# Altium schematic sheet SC941C_ETOR2.SchDoc: Entrées TOR 2/2
size 393 x 270 mm; CompanyName: Seccom; Address1: 521, rue du capt. François Garbit; Address2: 69440 Mornant; Address3: seccom@seccom.fr; Address4: www.seccom.fr; DocumentNumber: 4; SheetNumber: 4; SheetTotal: 9; PageSetup: Record=PageOptions|CenterHorizontal=True|CenterVertical=True|PrintScale=0.74|XCorrection=1.00|YCorrection=1.00|PrintKind=0|BorderSize=5000000|LeftOffset=0|BottomOffset=0|Orientation=2|PaperLength=1000|PaperWidth=1000|Scale=100|PaperSource=7|PrintQuality=-4|MediaType=1|DitherType=10|PaperKind=A4|PrintScaleMode=1
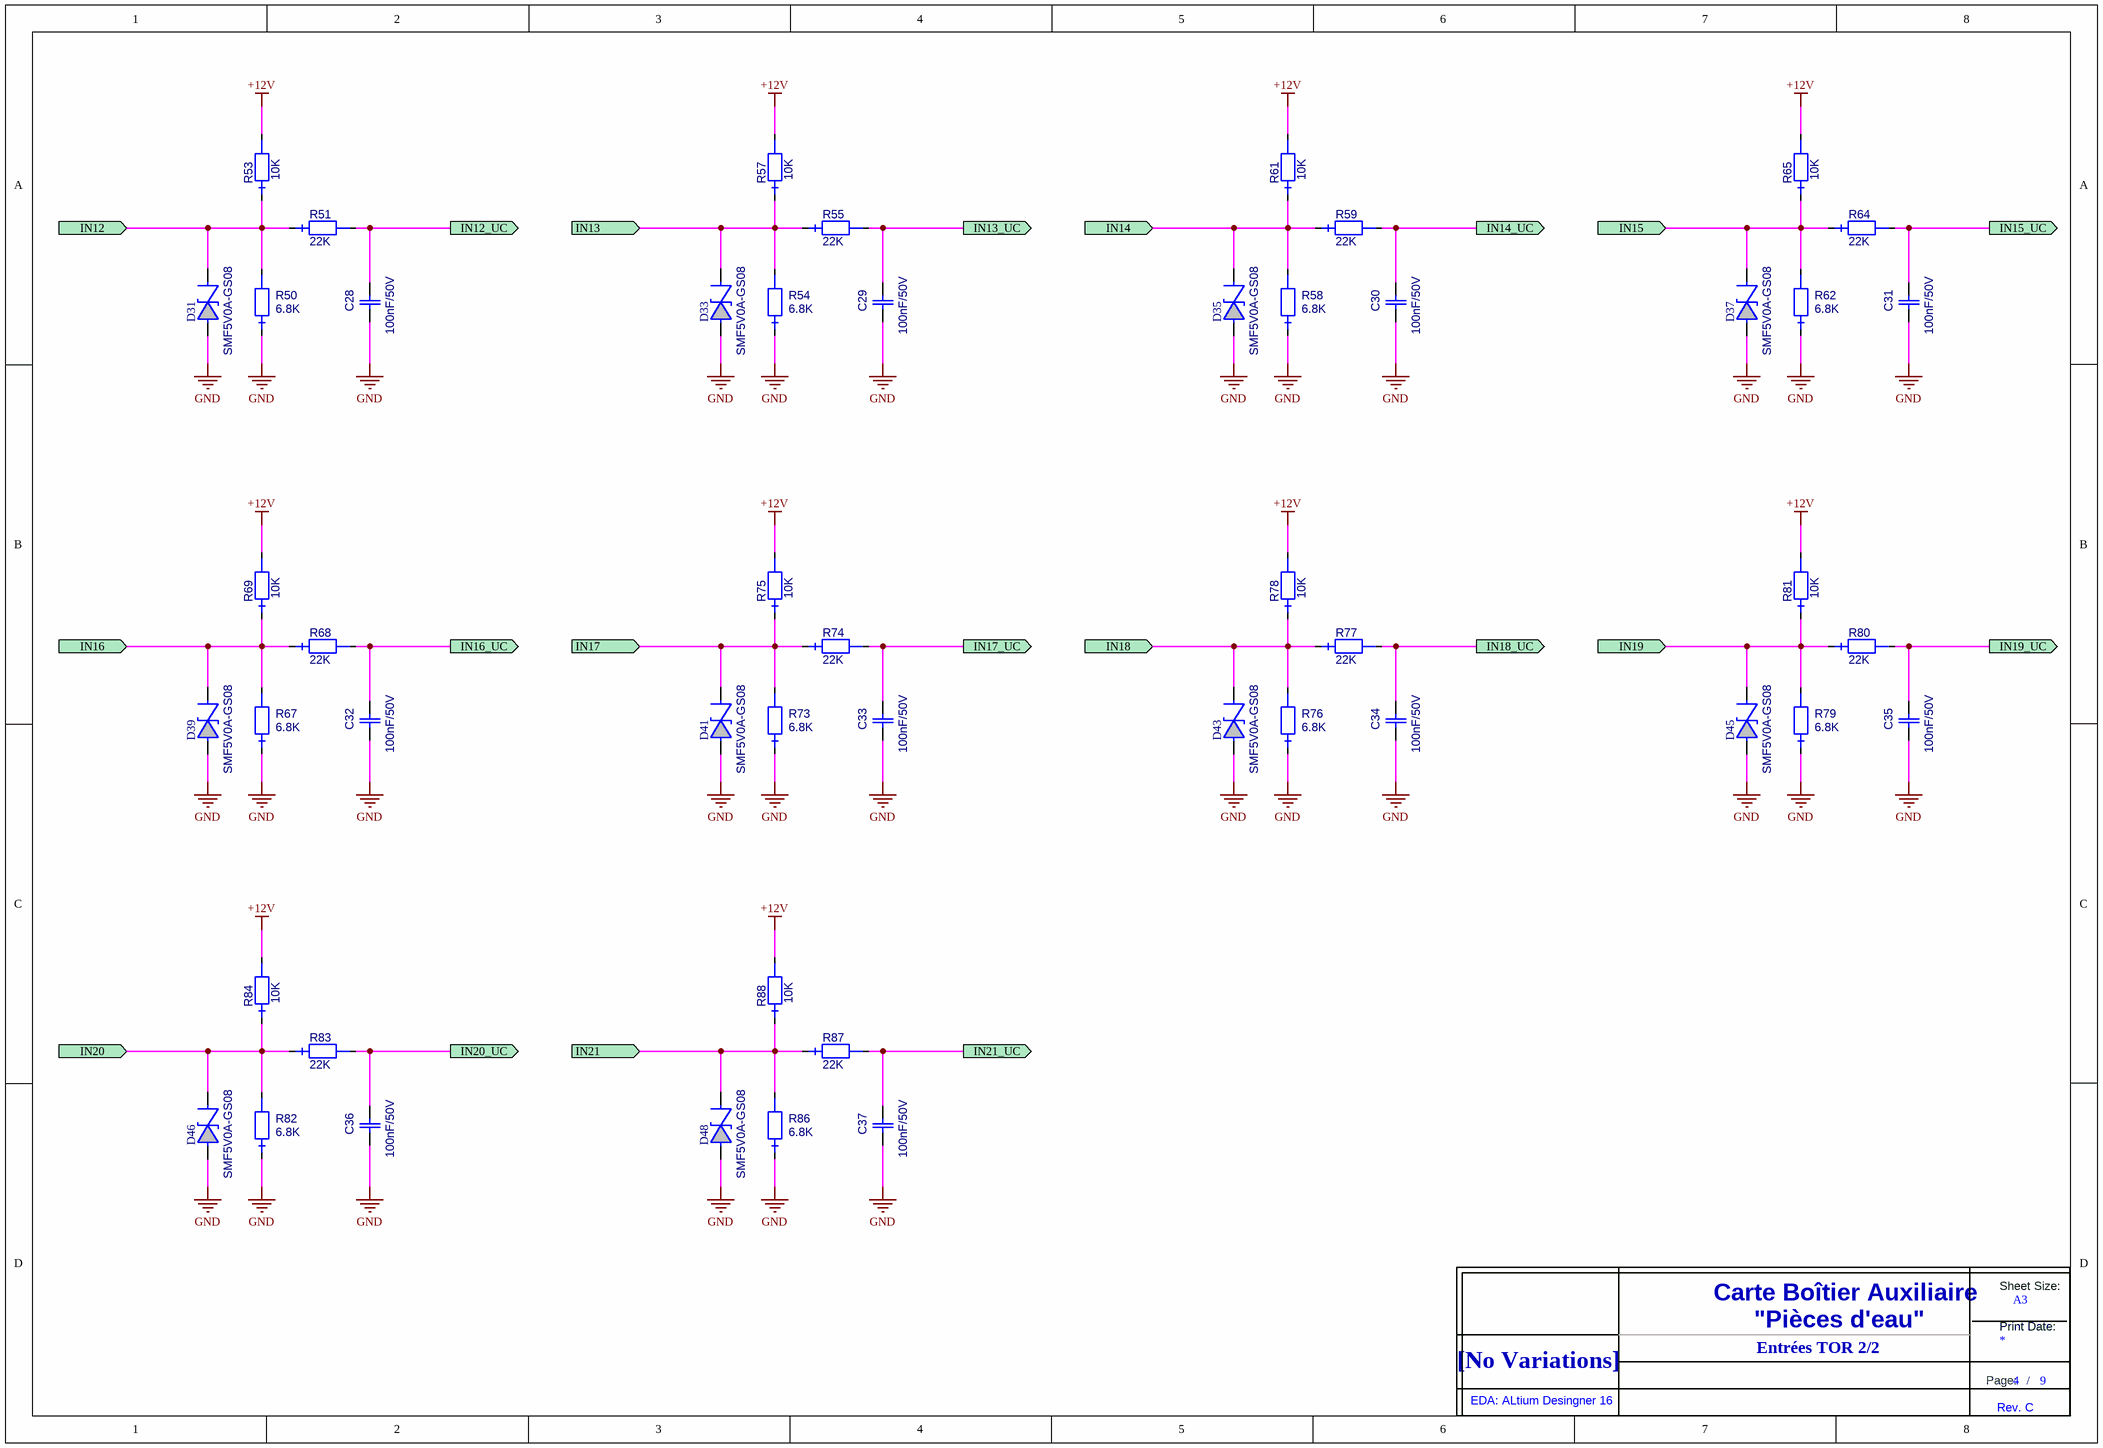
[diagram p0: SC941C_ETOR2.SchDoc]

## Parts
C28  value 100nF/50V  [0805_ReflowSoldering_CAP]  (hidden comment: C_0805_X7R_10%_100N-50V)
C29  value 100nF/50V  [0805_ReflowSoldering_CAP]  (hidden comment: C_0805_X7R_10%_100N-50V)
C30  value 100nF/50V  [0805_ReflowSoldering_CAP]  (hidden comment: C_0805_X7R_10%_100N-50V)
C31  value 100nF/50V  [0805_ReflowSoldering_CAP]  (hidden comment: C_0805_X7R_10%_100N-50V)
C32  value 100nF/50V  [0805_ReflowSoldering_CAP]  (hidden comment: C_0805_X7R_10%_100N-50V)
C33  value 100nF/50V  [0805_ReflowSoldering_CAP]  (hidden comment: C_0805_X7R_10%_100N-50V)
C34  value 100nF/50V  [0805_ReflowSoldering_CAP]  (hidden comment: C_0805_X7R_10%_100N-50V)
C35  value 100nF/50V  [0805_ReflowSoldering_CAP]  (hidden comment: C_0805_X7R_10%_100N-50V)
C36  value 100nF/50V  [0805_ReflowSoldering_CAP]  (hidden comment: C_0805_X7R_10%_100N-50V)
C37  value 100nF/50V  [0805_ReflowSoldering_CAP]  (hidden comment: C_0805_X7R_10%_100N-50V)
D31  SMF5V0A-GS08  [DO219AB-SMF-P_ReflowSoldering]
D33  SMF5V0A-GS08  [DO219AB-SMF-P_ReflowSoldering]
D35  SMF5V0A-GS08  [DO219AB-SMF-P_ReflowSoldering]
D37  SMF5V0A-GS08  [DO219AB-SMF-P_ReflowSoldering]
D39  SMF5V0A-GS08  [DO219AB-SMF-P_ReflowSoldering]
D41  SMF5V0A-GS08  [DO219AB-SMF-P_ReflowSoldering]
D43  SMF5V0A-GS08  [DO219AB-SMF-P_ReflowSoldering]
D45  SMF5V0A-GS08  [DO219AB-SMF-P_ReflowSoldering]
D46  SMF5V0A-GS08  [DO219AB-SMF-P_ReflowSoldering]
D48  SMF5V0A-GS08  [DO219AB-SMF-P_ReflowSoldering]
R50  value 6.8K  [0805_ReflowSoldering_RES]  (hidden comment: RES_0805_1%_100PPM_6.8K)
R51  value 22K  [0805_ReflowSoldering_RES]  (hidden comment: RES_0805_1%_100PPM_22K)
R53  value 10K  [0805_ReflowSoldering_RES]  (hidden comment: RES_0805_1%_100PPM_10K)
R54  value 6.8K  [0805_ReflowSoldering_RES]  (hidden comment: RES_0805_1%_100PPM_6.8K)
R55  value 22K  [0805_ReflowSoldering_RES]  (hidden comment: RES_0805_1%_100PPM_22K)
R57  value 10K  [0805_ReflowSoldering_RES]  (hidden comment: RES_0805_1%_100PPM_10K)
R58  value 6.8K  [0805_ReflowSoldering_RES]  (hidden comment: RES_0805_1%_100PPM_6.8K)
R59  value 22K  [0805_ReflowSoldering_RES]  (hidden comment: RES_0805_1%_100PPM_22K)
R61  value 10K  [0805_ReflowSoldering_RES]  (hidden comment: RES_0805_1%_100PPM_10K)
R62  value 6.8K  [0805_ReflowSoldering_RES]  (hidden comment: RES_0805_1%_100PPM_6.8K)
R64  value 22K  [0805_ReflowSoldering_RES]  (hidden comment: RES_0805_1%_100PPM_22K)
R65  value 10K  [0805_ReflowSoldering_RES]  (hidden comment: RES_0805_1%_100PPM_10K)
R67  value 6.8K  [0805_ReflowSoldering_RES]  (hidden comment: RES_0805_1%_100PPM_6.8K)
R68  value 22K  [0805_ReflowSoldering_RES]  (hidden comment: RES_0805_1%_100PPM_22K)
R69  value 10K  [0805_ReflowSoldering_RES]  (hidden comment: RES_0805_1%_100PPM_10K)
R73  value 6.8K  [0805_ReflowSoldering_RES]  (hidden comment: RES_0805_1%_100PPM_6.8K)
R74  value 22K  [0805_ReflowSoldering_RES]  (hidden comment: RES_0805_1%_100PPM_22K)
R75  value 10K  [0805_ReflowSoldering_RES]  (hidden comment: RES_0805_1%_100PPM_10K)
R76  value 6.8K  [0805_ReflowSoldering_RES]  (hidden comment: RES_0805_1%_100PPM_6.8K)
R77  value 22K  [0805_ReflowSoldering_RES]  (hidden comment: RES_0805_1%_100PPM_22K)
R78  value 10K  [0805_ReflowSoldering_RES]  (hidden comment: RES_0805_1%_100PPM_10K)
R79  value 6.8K  [0805_ReflowSoldering_RES]  (hidden comment: RES_0805_1%_100PPM_6.8K)
R80  value 22K  [0805_ReflowSoldering_RES]  (hidden comment: RES_0805_1%_100PPM_22K)
R81  value 10K  [0805_ReflowSoldering_RES]  (hidden comment: RES_0805_1%_100PPM_10K)
R82  value 6.8K  [0805_ReflowSoldering_RES]  (hidden comment: RES_0805_1%_100PPM_6.8K)
R83  value 22K  [0805_ReflowSoldering_RES]  (hidden comment: RES_0805_1%_100PPM_22K)
R84  value 10K  [0805_ReflowSoldering_RES]  (hidden comment: RES_0805_1%_100PPM_10K)
R86  value 6.8K  [0805_ReflowSoldering_RES]  (hidden comment: RES_0805_1%_100PPM_6.8K)
R87  value 22K  [0805_ReflowSoldering_RES]  (hidden comment: RES_0805_1%_100PPM_22K)
R88  value 10K  [0805_ReflowSoldering_RES]  (hidden comment: RES_0805_1%_100PPM_10K)
Title_new  DNI  (value not drawn)  (graphical)

## Ports
IN12 (in), IN12_UC (out), IN13 (in), IN13_UC (out), IN14 (in), IN14_UC (out), IN15 (in), IN15_UC (out), IN16 (in), IN16_UC (out), IN17 (in), IN17_UC (out), IN18 (in), IN18_UC (out), IN19 (in), IN19_UC (out), IN20 (in), IN20_UC (out), IN21 (in), IN21_UC (out)

## Nets
+12V: R53.2 R57.2 R61.2 R65.2 R69.2 R75.2 R78.2 R81.2 R84.2 R88.2
GND: C28.1 C29.1 C30.1 C31.1 C32.1 C33.1 C34.1 C35.1 C36.1 C37.1 D31.A D33.A D35.A D37.A D39.A D41.A D43.A D45.A D46.A D48.A R50.1 R54.1 R58.1 R62.1 R67.1 R73.1 R76.1 R79.1 R82.1 R86.1
IN12: D31.K R50.2 R51.1 R53.1 ; port IN12
IN12_UC: C28.2 R51.2 ; port IN12_UC
IN13: D33.K R54.2 R55.1 R57.1 ; port IN13
IN13_UC: C29.2 R55.2 ; port IN13_UC
IN14: D35.K R58.2 R59.1 R61.1 ; port IN14
IN14_UC: C30.2 R59.2 ; port IN14_UC
IN15: D37.K R62.2 R64.1 R65.1 ; port IN15
IN15_UC: C31.2 R64.2 ; port IN15_UC
IN16: D39.K R67.2 R68.1 R69.1 ; port IN16
IN16_UC: C32.2 R68.2 ; port IN16_UC
IN17: D41.K R73.2 R74.1 R75.1 ; port IN17
IN17_UC: C33.2 R74.2 ; port IN17_UC
IN18: D43.K R76.2 R77.1 R78.1 ; port IN18
IN18_UC: C34.2 R77.2 ; port IN18_UC
IN19: D45.K R79.2 R80.1 R81.1 ; port IN19
IN19_UC: C35.2 R80.2 ; port IN19_UC
IN20: D46.K R82.2 R83.1 R84.1 ; port IN20
IN20_UC: C36.2 R83.2 ; port IN20_UC
IN21: D48.K R86.2 R87.1 R88.1 ; port IN21
IN21_UC: C37.2 R87.2 ; port IN21_UC

## Notes on the sheet
- Entrées TOR 2/2
- (in symbol Title_new) Sheet Size:; Carte Boîtier Auxiliaire; A3; "Pièces d'eau"; Print Date:; [No Variations]; Page:; /; EDA: ALtium Desingner 16; Rev. C

## Library data of the parts
C28-C37 = C_0805_X7R_10%_100N-50V: Condensateur céramique, X7R, 10%, CMS 0805; Creation: LJ; Verification: LJ (28/05/04); Reference: 000042/00; Boitier: 0805; Remarque: {Remarque}; Fabricant: AVX; Ref Fab: 08055C104KAT2A; Coeff: 1; ComponentLink1URL: o:\_Documentation\Datasheets\BC_Components\Condo_CMS_NPO-X7R-Y5V.pdf; ComponentLink2URL: o:\_Documentation\Datasheets\_BOITIERS\PASSIF_CMS\RC_0805_(2x1,25)_(Schneider).PDF; Config: *; ComponentLink1Description: Datasheet; ComponentLink2Description: Datasheet Boitier; Supplier 1: Farnell; Supplier Part Number 1: 499687
D31 D33 D35 D37 D39 D41 D43 D45 D46 D48 = SMF5V0A-GS08: Diode Transil/TVS unidirectionnelle (A), 200W, 5V, CMS; Creation: LJ; Boitier: DO219AB/SMF; Remarque: {Remarque}; Fabricant: Vishay; Coeff: 1; Verification: *; Ref Fab: SMF5V0A-GS08; ComponentLink1URL: o:\_Documentation\Datasheets\Vishay\SMF5V0A~51A.pdf; ComponentLink2URL: o:\_Documentation\Datasheets\_BOITIERS\; Config: *; ComponentLink1Description: Datasheet; ComponentLink2Description: Datasheet Boitier; Value: SMF5V0A-GS08; Supplier 1: Farnell; Supplier 2: Mouser; Supplier Part Number 1: 1617696; Supplier Part Number 2: 78-SMF5V0A
R50 R54 R58 R62 R67 R73 R76 R79 R82 R86 = RES_0805_1%_100PPM_6.8K: Résistance CMS 0805, 0.125W, 1%, 100ppm, 150V; Creation: LJ (06/02/09); Reference: 000129/00; Boitier: 0805; Remarque: {Remarque}; Fabricant: Yageo; Ref Fab: RC0805FR-076K8L; Coeff: 1; Verification: *; ComponentLink1URL: o:\_Documentation\Datasheets\BC_Components\Resistances_ThickFilmFlatChip_0402-0603-0805-1206.pdf; ComponentLink2URL: o:\_Documentation\Datasheets\_BOITIERS\PASSIF_CMS\RC_0805_(2x1,25)_(Schneider).PDF; Config: *; ComponentLink1Description: Datasheet; ComponentLink2Description: Datasheet Boitier; Supplier 1: Farnell; Supplier Part Number 1: 9237739; Supplier 2: Mouser; Supplier Part Number 2: 603-RC0805FR-076K8L
R51 R55 R59 R64 R68 R74 R77 R80 R83 R87 = RES_0805_1%_100PPM_22K: Résistance CMS 0805, 0.125W, 1%, 100ppm, 150V; Creation: LJ (06/02/09); Reference: 000137/00; Boitier: 0805; Remarque: {Remarque}; Fabricant: Yageo; Ref Fab: RC0805FR-0722KL; Coeff: 1; Verification: *; ComponentLink1URL: o:\_Documentation\Datasheets\BC_Components\Resistances_ThickFilmFlatChip_0402-0603-0805-1206.pdf; ComponentLink2URL: o:\_Documentation\Datasheets\_BOITIERS\PASSIF_CMS\RC_0805_(2x1,25)_(Schneider).PDF; Config: *; ComponentLink1Description: Datasheet; ComponentLink2Description: Datasheet Boitier; Supplier 1: Farnell; Supplier Part Number 1: 9237798; Supplier 2: Mouser; Supplier Part Number 2: 603-RC0805FR-0722KL
R53 R57 R61 R65 R69 R75 R78 R81 R84 R88 = RES_0805_1%_100PPM_10K: Résistance CMS 0805, 0.125W, 1%, 100ppm, 150V; Creation: LJ (06/02/09); Reference: 000063/00; Boitier: 0805; Remarque: {Remarque}; Fabricant: Yageo; Ref Fab: RC0805FR-0710KL; Coeff: 1; Verification: *; ComponentLink1URL: o:\_Documentation\Datasheets\BC_Components\Resistances_ThickFilmFlatChip_0402-0603-0805-1206.pdf; ComponentLink2URL: o:\_Documentation\Datasheets\_BOITIERS\PASSIF_CMS\RC_0805_(2x1,25)_(Schneider).PDF; Config: *; ComponentLink1Description: Datasheet; ComponentLink2Description: Datasheet Boitier; Supplier 1: Farnell; Supplier Part Number 1: 9237755
Title_new = Title_new